# EAGLE schematic Blimp_nicla_standalone_IC (EAGLE 9.7.0)
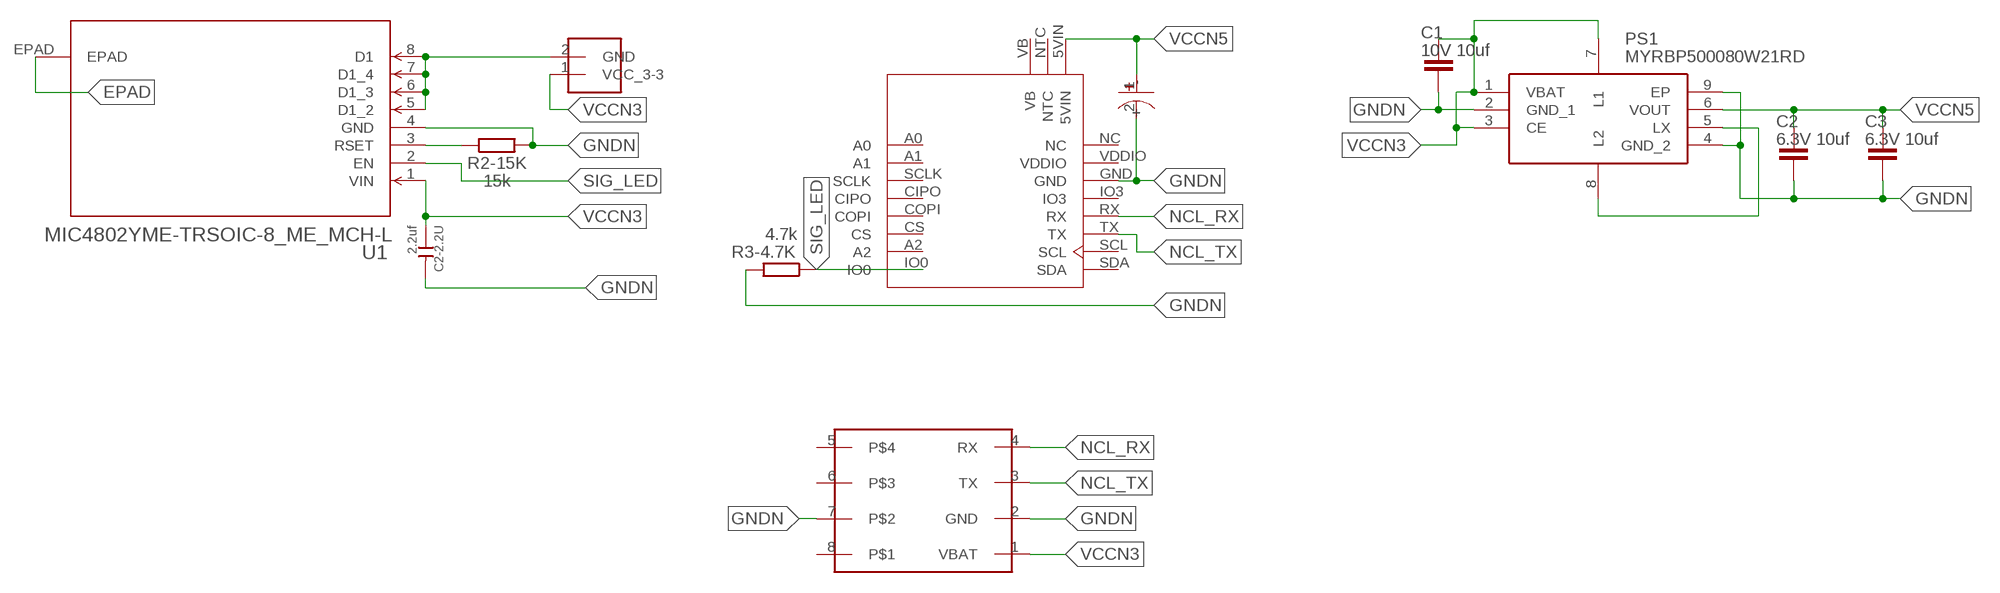
[diagram p0: schematic, sheet 1]

## Parts
C1  10V 10uf  C_CHIP-0603(1608-METRIC)  [CAPC1608X85]
C2  6.3V 10uf  C_CHIP-0603(1608-METRIC)  [CAPC1608X85]
C2-2.2U  2.2uf  CERAMIC-100PF-50V-5%-NPO(0402)  [C0402]
C3  6.3V 10uf  C_CHIP-0603(1608-METRIC)  [CAPC1608X85]
IR_LED1  UV_LIGHT  [UV_LIGHT]
PS1  MYRBP500080W21RD  [MYRBP500080W21RD]
R2-15K  15k  R_CHIP-0603(1608-METRIC)  [RESC1608X60]
R3-4.7K  4.7k  R_CHIP-0603(1608-METRIC)  [RESC1608X60]
U1  MIC4802YME-TRSOIC-8_ME_MCH-L  [SOIC-8_ME_MCH-L]
U$6  NICLA_ESP_4PIN_CONNECTOR_MALE_ON_NICLA  [ESP_NICLA_4X2PIN_CONNECTOR_MALE_ON_NICLA]
U$9  CUSTOM_C  [CAP]
U$15  NICLAVISION  [NICLA_FULL]

## Nets
EPAD: U1.EPAD
GNDN: C1.2 C2-2.2U.2 C2.2 C3.2 PS1.2(GND_1) PS1.4(GND_2) PS1.9(EP) R2-15K.2 R3-4.7K.2 U1.4(GND) U$6.2(GND) U$6.7 U$9.2(-) U$15.GND
N$1: IR_LED1.2(GND) U1.5(D1_2) U1.6(D1_3) U1.7(D1_4) U1.8(D1)
N$2: R2-15K.1 U1.3(RSET)
N$3: PS1.5(LX) PS1.8(L2)
NCL_RX: U$6.4(RX) U$15.RX
NCL_TX: U$6.3(TX) U$15.TX
SIG_LED: R3-4.7K.1 U1.2(EN) U$15.IO0
VCCN3: C1.1 C2-2.2U.1 IR_LED1.1(VCC_3-3) PS1.1(VBAT) PS1.3(CE) PS1.7(L1) U1.1(VIN) U$6.1(VBAT)
VCCN5: C2.1 C3.1 PS1.6(VOUT) U$9.1(+) U$15.5VIN
Unconnected: U$6.5 U$6.6 U$6.8 U$15.A0 U$15.A1 U$15.A2 U$15.CIPO U$15.COPI U$15.CS U$15.IO3 U$15.NC U$15.NTC U$15.SCL U$15.SCLK U$15.SDA

## Power pins joined to a net without a drawn wire
VB: U$15.VB
VDDIO: U$15.VDDIO

## Library data of the parts
C1-C3 = Capacitor:C: Capacitor - Generic; CATEGORY: Capacitor
C2-2.2U = OPL_Capacitor:CERAMIC-100PF-50V-5%-NPO(0402): 302010012; MPN: CC0402JRNPO9BN101; VALUE: 100pf
IR_LED1 = IMU_adaf:UV_LIGHT
PS1 = MYRBP500080W21RD:MYRBP500080W21RD: Non-Isolated DC/DC Converters Source: Datasheet <https://www.murata.com/products/productdata/8809985572894/MYRBP-B-W.pdf?1604930424000>; DESCRIPTION: Non-Isolated DC/DC Converters; HEIGHT: 1.04mm; MANUFACTURER_NAME: Murata Electronics; MANUFACTURER_PART_NUMBER: MYRBP500080W21RD; MOUSER_PART_NUMBER: 81-MYRBP500080W21RD; MOUSER_PRICE-STOCK: https://www.mouser.co.uk/ProductDetail/Murata-Electronics/MYRBP500080W21RD?qs=hd1VzrDQEGh%2Fg85ihM7iTw%3D%3D
R2-15K R3-4.7K = Resistor:R: Resistor Fixed - Generic; CATEGORY: Resistor; SUB-CATEGORY: Fixed
U1 = MIC4802-YME-TR:MIC4802YME-TR; COPYRIGHT: Copyright (C) 2024 Ultra Librarian. All rights reserved.; MANUFACTURER_PART_NUMBER: MIC4802YME-TR; MFR_NAME: Microchip
U$6 = NICLA_ESP_4PIN_CONNECTOR:NICLA_ESP_4PIN_CONNECTOR_MALE_ON_NICLA
U$9 = Electronics_Lib:CUSTOM_C
U$15 = nicla_vision:NICLAVISION